# Altium schematic sheet PCB1.SchDoc
size A; SheetNumber: 1; SheetTotal: 1
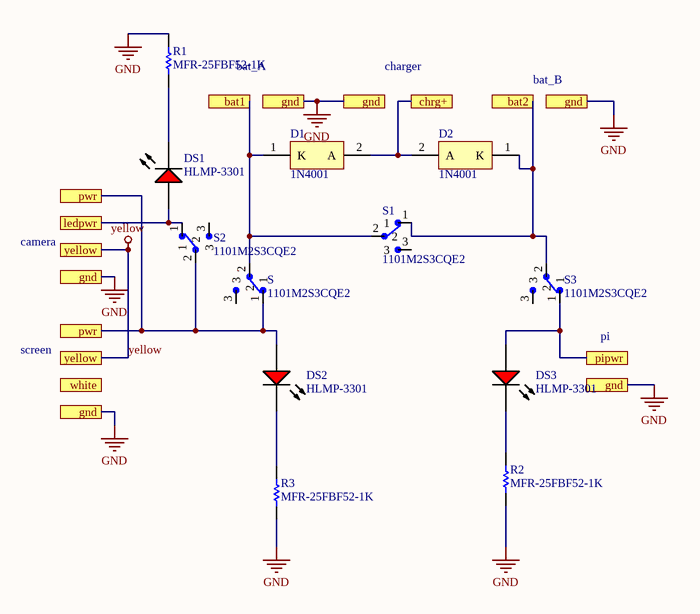
[diagram p0: PCB1.SchDoc]

## Parts
D1  1N4001  [ONSC-AXIAL_LEAD-2-59-10_P]
D2  1N4001  [ONSC-AXIAL_LEAD-2-59-10_P]
DS1  HLMP-3301  [AVAG-HLMP-3301-2]
DS2  HLMP-3301  [AVAG-HLMP-3301-2]
DS3  HLMP-3301  [AVAG-HLMP-3301-2]
R1  MFR-25FBF52-1K  [RESA60-630X240]
R2  MFR-25FBF52-1K  [RESA60-630X240]
R3  MFR-25FBF52-1K  [RESA60-630X240]
S  1101M2S3CQE2  [SW_1101M2S3CQE2]
S1  1101M2S3CQE2  [SW_1101M2S3CQE2]
S2  1101M2S3CQE2  [SW_1101M2S3CQE2]
S3  1101M2S3CQE2  [SW_1101M2S3CQE2]

## Ports
bat1, bat2, chrg+, gnd, ledpwr, pipwr, pwr, white, yellow

## Nets
GND: R1.2 R2.1 R3.1 ; port gnd
yellow: port yellow
bat1: D1.1(K) S.2 S1.2 ; port bat1
bat2: D2.1(K) S1.1 S3.2 ; port bat2
chrg+: D1.2(A) D2.2(A) ; port chrg+
ledpwr: DS1.2(A) S2.1 ; port ledpwr
pipwr: DS3.2(A) S3.1 ; port pipwr
pwr: DS2.2(A) S.1 S2.2 ; port pwr
NetDS1_1: DS1.1(K) R1.1
NetDS2_1: DS2.1(K) R3.2
NetDS3_1: DS3.1(K) R2.2

Not connected (* = marked no-connect by the designer): S 3; S1 3; S2 3; S3 3

## Notes on the sheet
- bat_A
- charger
- bat_B
- camera
- screen
- pi

## Library data of the parts
D1 D2 = CMP-0902-00117-1: Standard Recovery Rectifier, 2-Pin Axial_Lead, Pb-Free, Bulk Bag; Manufacturer: On Semiconductor; VRRM Max (V): 50; IFSM Max (A): 30; IO(rec) Max (A): 1; ComponentLink3URL: http://www.onsemi.cn/pub_link/Collateral/59-10.PDF; ComponentLink3Description: Package Specification; PartNumber: 1N4001; PackageVersion: Rev. U, 02/2005; Packing: Bulk Bag; ComponentLink2Description: Datasheet; RoHS: TRUE; DatasheetVersion: Rev. 13; PackageReference: AXIAL_LEAD-2-59-10; ComponentLink1URL: http://www.onsemi.com/; Mounting Technology: Through Hole; PackageDescription: 2-Pin, Axial Lead, Diameter 2.35 mm; ComponentLink2URL: http://www.onsemi.com/pub_link/Collateral/1N4001-D.PDF; Type: Standard Recovery; ComponentLink1Description: Manufacturer URL
DS1-DS3 = CMP-2000-06411-1: T-1 3/4 (5 mm) Diffused LED Lamp, 1.9 V, -40 to 100 degC, 2-Pin THD, RoHS, Bulk; Manufacturer: Avago; Forward Current: 25mA; Forward Voltage: 2.4V; Peak Wavelength: 635nm; Shape Type: Circular; High Brightness: No; Main Category: StandardLED; Test Current (It): 10mA; Dominant Wave Length: 626nm; Number of  Elements: 1; Reverse Voltage: 5V; Chip Material: GaP; Product Height (mm): 9.19mm; Lens Type: ColoredDiffused; Viewing Angle: 60deg; Type: Uni-Color; Emitting Color: Red; Luminous Intensity: 5.4mcd; Power Dissipation: 85W; DELETED: Compliant; Product Depth (mm): 6.1mm; Package Description: 2-Pin Through Hole LED, Dia 5.85 mm; Mounting Technology: ThroughHole; Manufacturer URL: http://www.avagotech.com/; Package Type: T-13/4; Operating Temp Range: -40Cto100C; Datasheet URL: http://www.avagotech.com/docs/AV02-1558EN; Mounting: ThroughHole; Lens Dimensions: 5.08x5.08x8.3mm; Package Reference: HLMP-3301; Datasheet Version: 03/2015; Pin Count: 2; Packaging: TapeandReel; Operating Temperature Classification: Industrial; Lum Intensity: 5.4mcd; Rad Hardened: No; Product Length (mm): 6.1mm
R1-R3 = CMP-1659-00075-1: Axial Resistor, 1 KOhm, +/- 1%, 250 mW, -55 to 155 degC, 2-Pin THD, RoHS, Bulk; Voltage Rating: 250 V; Resistance: 10 kohm; Power Rating: 250 mW; ComponentLink2Description: Datasheet; RoHSCompliant: true; PackageReference: MFR-25; Case\Package: Axial; Max Operating Temperature: 155 degC; DatasheetVersion: Apr-13; Tolerance: 1%; ComponentLink1URL: http://www.yageo.com/; Length: 0.248 inch; ComponentLink2URL: http://www.yageo.com/documents/recent/Yageo%20LR_MFR_2013.pdf; Packaging: Bulk; Package Quantity: 200; PackageDescription: 2-Pin Axial Lead, Dia 2.4 mm, Body Length 6.3 mm; Min Operating Temperature: -55 degC; ComponentLink1Description: Manufacturer URL
S S1-S3 = 1101M2S3CQE2: Slide Switch SPDT Through Hole; MF: C&K; SnapEDA_Link: https://www.snapeda.com/parts/1101M2S3CQE2/C%26K/view-part/287375/?ref=snap; MP: 1101M2S3CQE2; Value: *; Digi-Key_Part_Number: CKN5001-ND; Digi-Key_Purchase_URL: https://www.digikey.fr/product-detail/en/c-k/1101M2S3CQE2/CKN5001-ND/67042?utm_source=snapeda&utm_medium=aggregator&utm_campaign=symbol; Package: None